# Altium project plytka_swiecaca_altium_test.PrjPcb
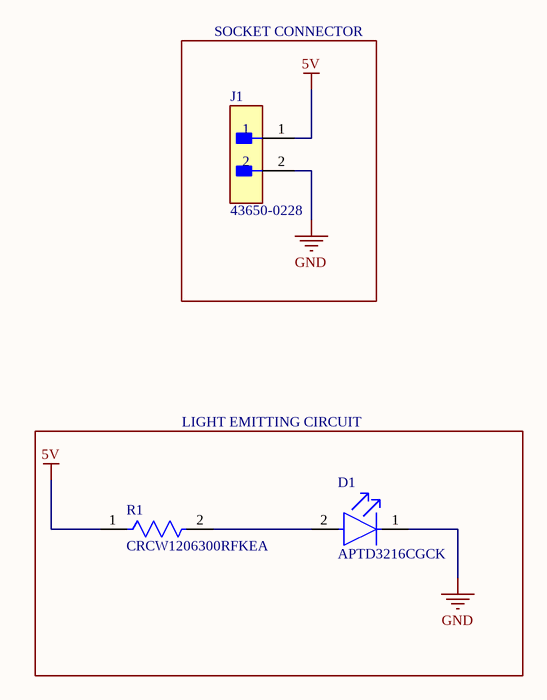
[diagram p0: Sheet1.SchDoc]
1 sheet, 3 parts. Net scope: global (net labels, ports and power ports of the same name join across sheets).
Board file: PCB1.PcbDoc

## Sheet Sheet1.SchDoc
size A4; SheetNumber: 1; SheetTotal: 1

### Parts
D1  APTD3216CGCK  [FP-APTD3216CGCK-MFG]
J1  43650-0228  [FP-436500228-MFG]
R1  CRCW1206300RFKEA  [FP-CRCW1206-e3-IPC_A]

### Blocks framed on the sheet
SOCKET CONNECTOR: J1
LIGHT EMITTING CIRCUIT: D1 R1

### Nets
5V: J1.1 R1.1
GND: D1.1(C) J1.2
NetD1_2: D1.2(A) R1.2

### Library data of the parts
D1 = CMP-2000-05792-2: LED GREEN CLEAR 2SMD; Forward Voltage: 2.1V; Forward Current: 20mA; Luminous Intensity: 300mcd; Number of LEDs: 1; Dominant Wavelength: 570nm; Viewing Angle: 50°; Lead Free: Lead Free; Lens Color: Clear; Mount: Surface Mount; Package Quantity: 2000; Height: 1.8mm; Number of Pins: 2; Test Current: 20mA; Case Code (Metric): 3216; Case/Package: 1206; Case Code (Imperial): 1206; Illumination Color: Green; Color: Green; Width: 1.6mm; Packaging: Tape and Reel; Min Operating Temperature: -40°C; Lens Style: Clear; Max Operating Temperature: 85°C; Length: 3.2mm
J1 = CMP-04776-000607-2: CONN HEADER VERT 2POS 3MM; Manufacturer Lifecycle Status: ACTIVE; NexarPartId: 7647538; Plating: Tin; Glow Wire Compliant: Compliant; Number of Contacts: 2; Current Rating: 5A; Voltage Rating: 250V; Max Operating Temperature: 125°C; Number of Rows: 1; Housing Material: Thermoplastic; RoHS: Compliant; Min Operating Temperature: -40°C; Country of Origin: US; Contact Material: Brass; Contact Plating: Gold; Number of Circuits: 2; Height: 10.15mm; Schedule B: 8536694040; Number of Pins: 2; Lifecycle Status: Production; Pitch: 3mm; Halogen Free: Low Halogen; Number of Positions: 2; Orientation: Vertical; Termination: Through Hole
R1 = CMP-1014-00449-3: RES Thick Film, 300Ω, 1%, 0.25W, 100ppm/°C, 1206; Voltage Rating (DC): 200V; Power Rating: 250mW; Resistance: 300R; Number of Terminations: 2; Weight: 0.000353oz; Max Operating Temperature: 155°C; Features: Automotive AEC-Q200; Min Operating Temperature: -55°C; Case Code (Imperial): 1206; Voltage Rating: 200V; Termination: SMD/SMT; Military Standard: Not; Composition: Thick Film; Tolerance: 1%; Mount: Surface Mount; Package Quantity: 10; Length: 3.2mm; Depth: 1.6mm; Temperature Coefficient: 100ppm/°C; Width: 0.063inch; Contact Plating: Tin; Lead Free: Lead Free; Case Code (Metric): 3216; Radiation Hardening: No; Max Power Dissipation: 250mW; Working Voltage: 200V; Packaging: Tape and Reel; Height: 0.55mm; Case/Package: 1206